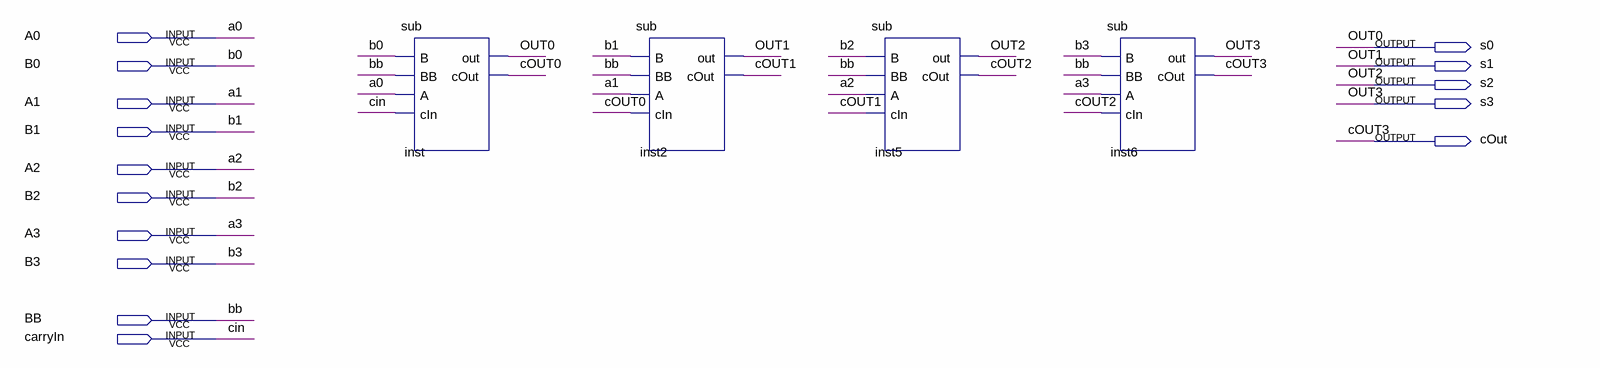
[diagram p0: schematic sheet]
// Quartus schematic add_sub.bdf as structural Verilog: 4 symbols, 15 pins
module add_sub (
  input  A0,
  input  B0,
  input  A1,
  input  B1,
  input  A2,
  input  B2,
  input  A3,
  input  B3,
  input  BB,
  input  carryIn,
  output s0,
  output s1,
  output s2,
  output s3,
  output cOut
);

  wire cOUT0, cOUT1, cOUT2;

  sub inst (.B(B0), .BB(BB), .A(A0), .cIn(carryIn), .out(s0), .cOut(cOUT0));
  sub inst2 (.B(B1), .BB(BB), .A(A1), .cIn(cOUT0), .out(s1), .cOut(cOUT1));
  sub inst5 (.B(B2), .BB(BB), .A(A2), .cIn(cOUT1), .out(s2), .cOut(cOUT2));
  sub inst6 (.B(B3), .BB(BB), .A(A3), .cIn(cOUT2), .out(s3), .cOut(cOut));

  // Other names for the same wires on the sheet: cin = carryIn; cOUT3 = cOut; OUT0 = s0; OUT1 = s1; OUT2 = s2;
  //   OUT3 = s3
endmodule
